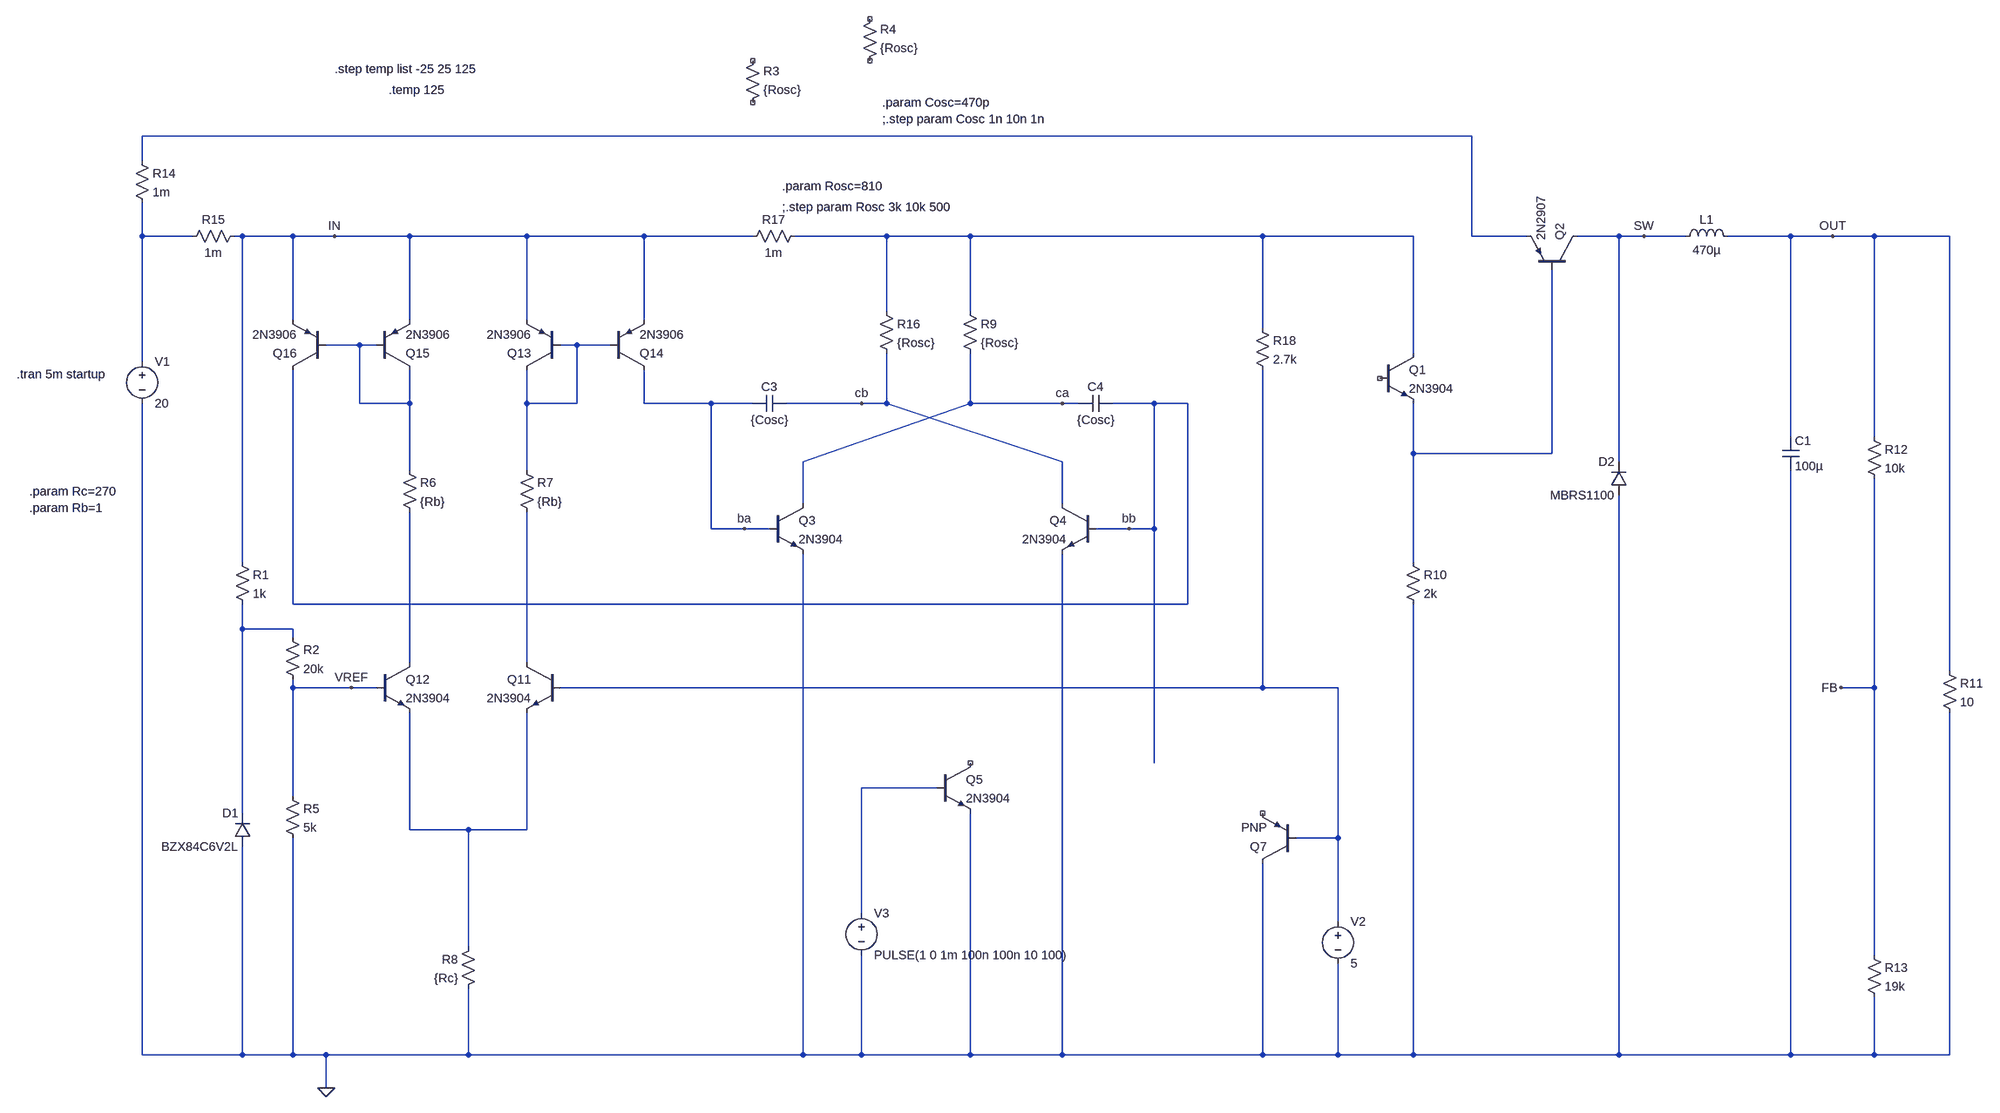
[diagram p0: schematic step_down1.asc]
step_down1.asc, the LTspice schematic file:
Version 4.1
SHEET 1 4228 3748
WIRE 3184 1824 544 1824
WIRE 544 1872 544 1824
WIRE 544 2016 544 1952
WIRE 640 2016 544 2016
WIRE 736 2016 720 2016
WIRE 832 2016 736 2016
WIRE 912 2016 832 2016
WIRE 1056 2016 912 2016
WIRE 1280 2016 1056 2016
WIRE 1504 2016 1280 2016
WIRE 1712 2016 1504 2016
WIRE 1968 2016 1792 2016
WIRE 2128 2016 1968 2016
WIRE 2784 2016 2128 2016
WIRE 3072 2016 2784 2016
WIRE 3184 2016 3184 1824
WIRE 3296 2016 3184 2016
WIRE 3472 2016 3392 2016
WIRE 3520 2016 3472 2016
WIRE 3600 2016 3520 2016
WIRE 3856 2016 3680 2016
WIRE 3936 2016 3856 2016
WIRE 4016 2016 3936 2016
WIRE 4160 2016 4016 2016
WIRE 1968 2160 1968 2016
WIRE 2128 2160 2128 2016
WIRE 832 2176 832 2016
WIRE 1056 2176 1056 2016
WIRE 1280 2176 1280 2016
WIRE 1504 2176 1504 2016
WIRE 2784 2192 2784 2016
WIRE 960 2224 896 2224
WIRE 992 2224 960 2224
WIRE 1376 2224 1344 2224
WIRE 1440 2224 1376 2224
WIRE 3072 2240 3072 2016
WIRE 544 2256 544 2016
WIRE 960 2336 960 2224
WIRE 1056 2336 1056 2272
WIRE 1056 2336 960 2336
WIRE 1280 2336 1280 2272
WIRE 1376 2336 1376 2224
WIRE 1376 2336 1280 2336
WIRE 1504 2336 1504 2272
WIRE 1632 2336 1504 2336
WIRE 1712 2336 1632 2336
WIRE 1920 2336 1776 2336
WIRE 1968 2336 1968 2240
WIRE 1968 2336 1920 2336
WIRE 2128 2336 2128 2240
WIRE 2304 2336 2128 2336
WIRE 2336 2336 2304 2336
WIRE 2480 2336 2400 2336
WIRE 2544 2336 2480 2336
WIRE 3856 2400 3856 2016
WIRE 4016 2400 4016 2016
WIRE 3072 2432 3072 2336
WIRE 3344 2432 3344 2080
WIRE 3344 2432 3072 2432
WIRE 1808 2448 2128 2336
WIRE 2304 2448 1968 2336
WIRE 3472 2448 3472 2016
WIRE 1056 2464 1056 2336
WIRE 1280 2464 1280 2336
WIRE 1808 2528 1808 2448
WIRE 2304 2528 2304 2448
WIRE 1632 2576 1632 2336
WIRE 1696 2576 1632 2576
WIRE 1744 2576 1696 2576
WIRE 2432 2576 2368 2576
WIRE 2480 2576 2480 2336
WIRE 2480 2576 2432 2576
WIRE 736 2640 736 2016
WIRE 3072 2640 3072 2432
WIRE 832 2720 832 2272
WIRE 2544 2720 2544 2336
WIRE 2544 2720 832 2720
WIRE 736 2768 736 2720
WIRE 832 2768 736 2768
WIRE 832 2784 832 2768
WIRE 1056 2832 1056 2544
WIRE 1280 2832 1280 2544
WIRE 4160 2848 4160 2016
WIRE 832 2880 832 2864
WIRE 944 2880 832 2880
WIRE 992 2880 944 2880
WIRE 2784 2880 2784 2272
WIRE 2784 2880 1344 2880
WIRE 2928 2880 2784 2880
WIRE 4016 2880 4016 2480
WIRE 4016 2880 3952 2880
WIRE 2480 3024 2480 2576
WIRE 2064 3072 1920 3072
WIRE 832 3088 832 2880
WIRE 736 3120 736 2768
WIRE 1056 3152 1056 2928
WIRE 1168 3152 1056 3152
WIRE 1280 3152 1280 2928
WIRE 1280 3152 1168 3152
WIRE 2928 3168 2928 2880
WIRE 2928 3168 2848 3168
WIRE 1920 3312 1920 3072
WIRE 2928 3328 2928 3168
WIRE 1168 3376 1168 3152
WIRE 4016 3392 4016 2880
WIRE 544 3664 544 2336
WIRE 736 3664 736 3184
WIRE 736 3664 544 3664
WIRE 832 3664 832 3168
WIRE 832 3664 736 3664
WIRE 896 3664 832 3664
WIRE 1168 3664 1168 3456
WIRE 1168 3664 896 3664
WIRE 1808 3664 1808 2624
WIRE 1808 3664 1168 3664
WIRE 1920 3664 1920 3392
WIRE 1920 3664 1808 3664
WIRE 2128 3664 2128 3120
WIRE 2128 3664 1920 3664
WIRE 2304 3664 2304 2624
WIRE 2304 3664 2128 3664
WIRE 2784 3664 2784 3216
WIRE 2784 3664 2304 3664
WIRE 2928 3664 2928 3408
WIRE 2928 3664 2784 3664
WIRE 3072 3664 3072 2720
WIRE 3072 3664 2928 3664
WIRE 3472 3664 3472 2512
WIRE 3472 3664 3072 3664
WIRE 3856 3664 3856 2464
WIRE 3856 3664 3472 3664
WIRE 4016 3664 4016 3472
WIRE 4016 3664 3856 3664
WIRE 4160 3664 4160 2928
WIRE 4160 3664 4016 3664
WIRE 896 3728 896 3664
FLAG 896 3728 0
FLAG 3936 2016 OUT
FLAG 3520 2016 SW
FLAG 3952 2880 FB
FLAG 912 2016 IN
FLAG 944 2880 VREF
FLAG 2304 2336 ca
FLAG 1920 2336 cb
FLAG 1696 2576 ba
FLAG 2432 2576 bb
SYMBOL voltage 544 2240 R0
SYMATTR InstName V1
SYMATTR Value 20
SYMBOL res 1184 3360 M0
SYMATTR InstName R8
SYMATTR Value {Rc}
SYMBOL npn 1344 2832 M0
SYMATTR InstName Q11
SYMATTR Value 2N3904
SYMBOL npn 992 2832 R0
SYMATTR InstName Q12
SYMATTR Value 2N3904
SYMBOL res 1040 2448 R0
SYMATTR InstName R6
SYMATTR Value {Rb}
SYMBOL res 1264 2448 R0
SYMATTR InstName R7
SYMATTR Value {Rb}
SYMBOL pnp 1344 2272 R180
SYMATTR InstName Q13
SYMATTR Value 2N3906
SYMBOL pnp 1440 2272 M180
SYMATTR InstName Q14
SYMATTR Value 2N3906
SYMBOL pnp 992 2272 M180
SYMATTR InstName Q15
SYMATTR Value 2N3906
SYMBOL pnp 896 2272 R180
SYMATTR InstName Q16
SYMATTR Value 2N3906
SYMBOL npn 1744 2528 R0
SYMATTR InstName Q3
SYMATTR Value 2N3904
SYMBOL npn 2368 2528 M0
SYMATTR InstName Q4
SYMATTR Value 2N3904
SYMBOL res 1696 1776 M180
WINDOW 0 36 76 Left 2
WINDOW 3 36 40 Left 2
SYMATTR InstName R3
SYMATTR Value {Rosc}
SYMBOL res 1920 1696 M180
WINDOW 0 36 76 Left 2
WINDOW 3 36 40 Left 2
SYMATTR InstName R4
SYMATTR Value {Rosc}
SYMBOL cap 1776 2352 M270
WINDOW 0 32 32 VTop 2
WINDOW 3 0 32 VBottom 2
SYMATTR InstName C3
SYMATTR Value {Cosc}
SYMBOL cap 2400 2352 M270
WINDOW 0 32 32 VTop 2
WINDOW 3 0 32 VBottom 2
SYMATTR InstName C4
SYMATTR Value {Cosc}
SYMBOL diode 752 3184 R180
WINDOW 0 24 64 Left 2
WINDOW 3 24 0 Left 2
SYMATTR InstName D1
SYMATTR Value BZX84C6V2L
SYMBOL res 720 2624 R0
SYMATTR InstName R1
SYMATTR Value 1k
SYMBOL res 816 2768 R0
SYMATTR InstName R2
SYMATTR Value 20k
SYMBOL res 816 3072 R0
SYMATTR InstName R5
SYMATTR Value 5k
SYMBOL npn 3008 2240 R0
SYMATTR InstName Q1
SYMATTR Value 2N3904
SYMBOL res 3056 2624 R0
SYMATTR InstName R10
SYMATTR Value 2k
SYMBOL res 4144 2832 R0
SYMATTR InstName R11
SYMATTR Value 10
SYMBOL ind 3584 2032 R270
WINDOW 0 32 56 VTop 2
WINDOW 3 5 56 VBottom 2
SYMATTR InstName L1
SYMATTR Value 470µ
SYMATTR SpiceLine Rser=1m
SYMBOL cap 3840 2400 R0
SYMATTR InstName C1
SYMATTR Value 100µ
SYMBOL diode 3488 2512 R180
WINDOW 0 24 64 Left 2
WINDOW 3 24 0 Left 2
SYMATTR InstName D2
SYMATTR Value MBRS1100
SYMBOL res 4000 2384 R0
SYMATTR InstName R12
SYMATTR Value 10k
SYMBOL res 4000 3376 R0
SYMATTR InstName R13
SYMATTR Value 19k
SYMBOL pnp 3392 2080 M270
SYMATTR InstName Q2
SYMATTR Value 2N2907
SYMBOL voltage 2928 3312 R0
WINDOW 123 0 0 Left 0
WINDOW 39 0 0 Left 0
SYMATTR InstName V2
SYMATTR Value 5
SYMBOL res 528 1856 R0
SYMATTR InstName R14
SYMATTR Value 1m
SYMBOL res 624 2032 R270
WINDOW 0 32 56 VTop 2
WINDOW 3 0 56 VBottom 2
SYMATTR InstName R15
SYMATTR Value 1m
SYMBOL res 2112 2144 R0
SYMATTR InstName R9
SYMATTR Value {Rosc}
SYMBOL res 1952 2144 R0
SYMATTR InstName R16
SYMATTR Value {Rosc}
SYMBOL res 1696 2032 R270
WINDOW 0 32 56 VTop 2
WINDOW 3 0 56 VBottom 2
SYMATTR InstName R17
SYMATTR Value 1m
SYMBOL npn 2064 3024 R0
SYMATTR InstName Q5
SYMATTR Value 2N3904
SYMBOL voltage 1920 3296 R0
WINDOW 123 0 0 Left 0
WINDOW 39 0 0 Left 0
SYMATTR InstName V3
SYMATTR Value PULSE(1 0 1m 100n 100n 10 100)
SYMBOL pnp 2848 3216 R180
SYMATTR InstName Q7
SYMBOL res 2768 2176 R0
SYMATTR InstName R18
SYMATTR Value 2.7k
TEXT 304 2280 Left 2 !.tran 5m startup
TEXT 328 2504 Left 2 !.param Rc=270
TEXT 328 2536 Left 2 !.param Rb=1
TEXT 1768 1920 Left 2 !.param Rosc=810
TEXT 1768 1960 Left 2 !;.step param Rosc 3k 10k 500
TEXT 1960 1760 Left 2 !.param Cosc=470p
TEXT 1960 1792 Left 2 !;.step param Cosc 1n 10n 1n
TEXT 912 1696 Left 2 !.step temp list -25 25 125
TEXT 1016 1736 Left 2 !.temp 125

The netlist it stands for:
* step_down1.asc
V1 N002 0 20
R8 N012 0 {Rc}
Q11 N009 N010 N012 0 2N3904
Q12 N008 VREF N012 0 2N3904
R6 N004 N008 {Rb}
R7 N005 N009 {Rb}
Q13 N005 N005 IN 0 2N3906
Q14 ba N005 IN 0 2N3906
Q15 N004 N004 IN 0 2N3906
Q16 bb N004 IN 0 2N3906
Q3 ca ba 0 0 2N3904
Q4 cb bb 0 0 2N3904
R3 NC_01 NC_02 {Rosc}
R4 NC_03 NC_04 {Rosc}
C3 cb ba {Cosc}
C4 bb ca {Cosc}
D1 0 N007 BZX84C6V2L
R1 IN N007 1k
R2 N007 VREF 20k
R5 VREF 0 5k
Q1 N003 NC_05 N006 0 2N3904
R10 N006 0 2k
R11 OUT 0 10
L1 SW OUT 470µ Rser=1m
C1 OUT 0 100µ
D2 0 SW MBRS1100
R12 OUT FB 10k
R13 FB 0 19k
Q2 SW N006 N001 0 2N2907
V2 N010 0 5
R14 N001 N002 1m
R15 N002 IN 1m
R9 N003 ca {Rosc}
R16 N003 cb {Rosc}
R17 IN N003 1m
Q5 NC_06 N011 0 0 2N3904
V3 N011 0 PULSE(1 0 1m 100n 100n 10 100)
Q7 0 N010 NC_07 0 PNP
R18 N003 N010 2.7k
.model D D
.lib standard.dio
.model NPN NPN
.model PNP PNP
.lib standard.bjt
.tran 5m startup
.param Rc=270
.param Rb=1
.param Rosc=810
;.step param Rosc 3k 10k 500
.param Cosc=470p
;.step param Cosc 1n 10n 1n
.step temp list -25 25 125
.temp 125
.backanno
.end